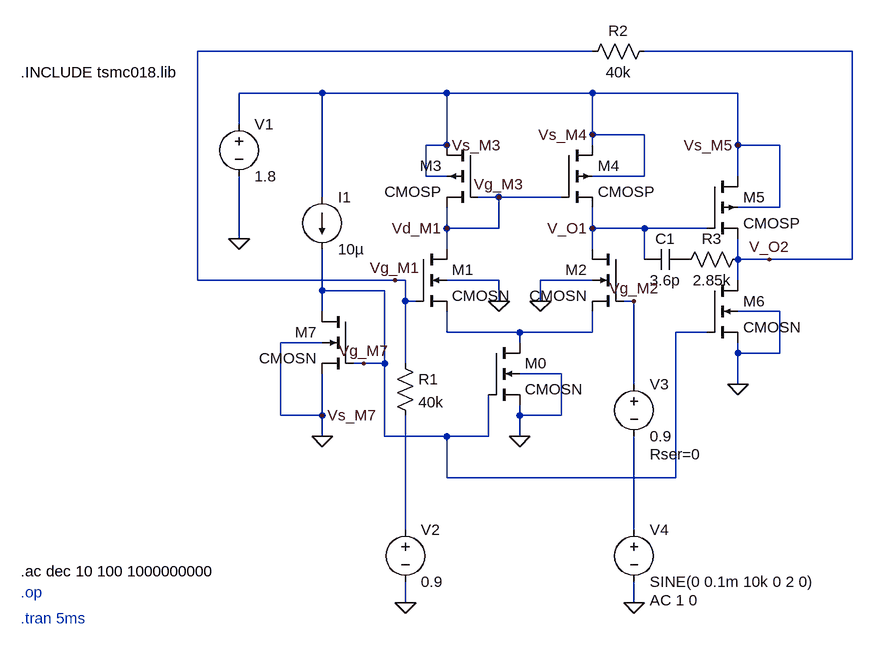
[diagram p0: schematic 230108034_OTA_Design.asc.asc]
230108034_OTA_Design.asc.asc, the LTspice schematic file:
Version 4
SHEET 1 880 792
WIRE 352 -96 -256 -96
WIRE 752 -96 432 -96
WIRE -64 -32 -192 -32
WIRE 128 -32 -64 -32
WIRE 352 -32 128 -32
WIRE 576 -32 352 -32
WIRE -192 16 -192 -32
WIRE 352 32 352 -32
WIRE 432 32 352 32
WIRE 128 48 128 -32
WIRE 128 48 96 48
WIRE 352 48 352 32
WIRE 576 48 576 -32
WIRE 640 48 576 48
WIRE 128 64 128 48
WIRE 96 96 96 48
WIRE 128 96 96 96
WIRE 432 96 432 32
WIRE 432 96 352 96
WIRE 576 96 576 48
WIRE -64 128 -64 -32
WIRE 208 128 176 128
WIRE 304 128 208 128
WIRE 640 144 640 48
WIRE 640 144 576 144
WIRE 128 176 128 144
WIRE 208 176 208 128
WIRE 208 176 128 176
WIRE 352 176 352 144
WIRE 432 176 352 176
WIRE 528 176 432 176
WIRE -192 192 -192 96
WIRE 128 208 128 176
WIRE 352 208 352 176
WIRE 432 224 432 176
WIRE 576 224 576 192
WIRE 624 224 576 224
WIRE 752 224 752 -96
WIRE 752 224 624 224
WIRE -256 256 -256 -96
WIRE 48 256 -256 256
WIRE 64 256 48 256
WIRE 208 256 128 256
WIRE 352 256 272 256
WIRE 576 256 576 224
WIRE -64 272 -64 208
WIRE 32 272 -64 272
WIRE 64 288 64 256
WIRE 80 288 64 288
WIRE 208 288 208 256
WIRE 272 288 272 256
WIRE 416 288 400 288
WIRE -64 304 -64 272
WIRE 640 304 576 304
WIRE 128 336 128 304
WIRE 240 336 128 336
WIRE 352 336 352 304
WIRE 352 336 240 336
WIRE 528 336 480 336
WIRE -64 352 -128 352
WIRE 240 352 240 336
WIRE 576 368 576 352
WIRE 640 368 640 304
WIRE 640 368 576 368
WIRE 0 384 -16 384
WIRE 32 384 32 272
WIRE 32 384 0 384
WIRE 64 384 64 288
WIRE 304 400 240 400
WIRE 416 416 416 288
WIRE 576 416 576 368
WIRE -128 464 -128 352
WIRE -64 464 -64 400
WIRE -64 464 -128 464
WIRE 240 464 240 448
WIRE 304 464 304 400
WIRE 304 464 240 464
WIRE -64 496 -64 464
WIRE 32 496 32 384
WIRE 128 496 32 496
WIRE 192 496 192 432
WIRE 192 496 128 496
WIRE 240 496 240 464
WIRE 128 560 128 496
WIRE 480 560 480 336
WIRE 480 560 128 560
WIRE 64 640 64 464
WIRE 416 640 416 496
WIRE 64 752 64 720
WIRE 416 752 416 720
FLAG 208 288 0
FLAG 272 288 0
FLAG 240 496 0
FLAG 576 416 0
FLAG -64 496 0
FLAG 64 752 0
FLAG 416 752 0
FLAG -192 192 0
FLAG 624 224 V_O2
FLAG 128 176 Vd_M1
FLAG 48 256 Vg_M1
FLAG 0 384 Vg_M7
FLAG -64 464 Vs_M7
FLAG 208 128 Vg_M3
FLAG 128 48 Vs_M3
FLAG 352 32 Vs_M4
FLAG 576 48 Vs_M5
FLAG 416 288 Vg_M2
FLAG 352 176 V_O1
SYMBOL cmosp 176 48 M0
SYMATTR InstName M3
SYMATTR Value2 l=360n w=36000n
SYMBOL cmosp 304 48 R0
SYMATTR InstName M4
SYMATTR Value2 l=360n w=36000n
SYMBOL cmosn 80 208 R0
SYMATTR InstName M1
SYMATTR Value2 l=360n w=15652.152n
SYMBOL cmosn 400 208 M0
SYMATTR InstName M2
SYMATTR Value2 l=360n w=15652.152n
SYMBOL cmosn 192 352 R0
SYMATTR InstName M0
SYMATTR Value2 l=360n w=31304.34n
SYMBOL cmosn -16 304 M0
SYMATTR InstName M7
SYMATTR Value2 l=360n w=3130.434n
SYMBOL cmosp 528 96 R0
SYMATTR InstName M5
SYMATTR Value2 l=360n w=14400n
SYMBOL cmosn 528 256 R0
SYMATTR InstName M6
SYMATTR Value2 l=360n w=6260.868n
SYMBOL current -64 128 R0
WINDOW 123 0 0 Left 0
WINDOW 39 0 0 Left 0
SYMATTR InstName I1
SYMATTR Value 10µ
SYMBOL voltage 64 624 R0
WINDOW 123 0 0 Left 0
WINDOW 39 0 0 Left 0
SYMATTR InstName V2
SYMATTR Value 0.9
SYMBOL voltage -192 0 R0
WINDOW 123 0 0 Left 0
WINDOW 39 0 0 Left 0
SYMATTR InstName V1
SYMATTR Value 1.8
SYMBOL voltage 416 400 R0
WINDOW 123 0 0 Left 0
WINDOW 39 24 124 Left 2
SYMATTR SpiceLine Rser=0
SYMATTR InstName V3
SYMATTR Value 0.9
SYMBOL voltage 416 624 R0
WINDOW 123 24 124 Left 2
WINDOW 39 0 0 Left 0
SYMATTR Value2 AC 1 0
SYMATTR InstName V4
SYMATTR Value SINE(0 0.1m 10k 0 2 0)
SYMBOL res 48 368 R0
SYMATTR InstName R1
SYMATTR Value 40k
SYMBOL res 448 -112 R90
WINDOW 0 0 56 VBottom 2
WINDOW 3 32 56 VTop 2
SYMATTR InstName R2
SYMATTR Value 40k
SYMBOL res 592 208 R90
WINDOW 0 0 56 VBottom 2
WINDOW 3 32 56 VTop 2
SYMATTR InstName R3
SYMATTR Value 2.85k
SYMBOL cap 496 208 R90
WINDOW 0 0 32 VBottom 2
WINDOW 3 32 32 VTop 2
SYMATTR InstName C1
SYMATTR Value 3.6p
TEXT -528 -64 Left 2 !.INCLUDE tsmc018.lib
TEXT -528 776 Left 2 ;.tran 5ms
TEXT -528 736 Left 2 ;.op
TEXT -528 704 Left 2 !.ac dec 10 100 1000000000

The netlist it stands for:
* 230108034_OTA_Design.asc.asc
M3 Vs_M5 Vg_M3 Vg_M3 Vs_M5 CMOSP l=360n w=36000n
M4 Vs_M5 Vg_M3 V_O1 Vs_M5 CMOSP l=360n w=36000n
M1 Vg_M3 Vg_M1 N001 0 CMOSN l=360n w=15652.152n
M2 V_O1 Vg_M2 N001 0 CMOSN l=360n w=15652.152n
M0 N001 Vg_M7 0 0 CMOSN l=360n w=31304.34n
M7 Vg_M7 Vg_M7 0 0 CMOSN l=360n w=3130.434n
M5 Vs_M5 V_O1 V_O2 Vs_M5 CMOSP l=360n w=14400n
M6 V_O2 Vg_M7 0 0 CMOSN l=360n w=6260.868n
I1 Vs_M5 Vg_M7 10µ
V2 N002 0 0.9
V1 Vs_M5 0 1.8
V3 Vg_M2 N003 0.9 Rser=0
V4 N003 0 SINE(0 0.1m 10k 0 2 0) AC 1 0
R1 Vg_M1 N002 40k
R2 V_O2 Vg_M1 40k
R3 V_O2 P001 2.85k
C1 P001 V_O1 3.6p
.model NMOS NMOS
.model PMOS PMOS
.lib standard.mos
.INCLUDE tsmc018.lib
* .tran 5ms
* .op
.ac dec 10 100 1000000000
.backanno
.end